# Altium schematic sheet W5500_2.SchDoc
size A4
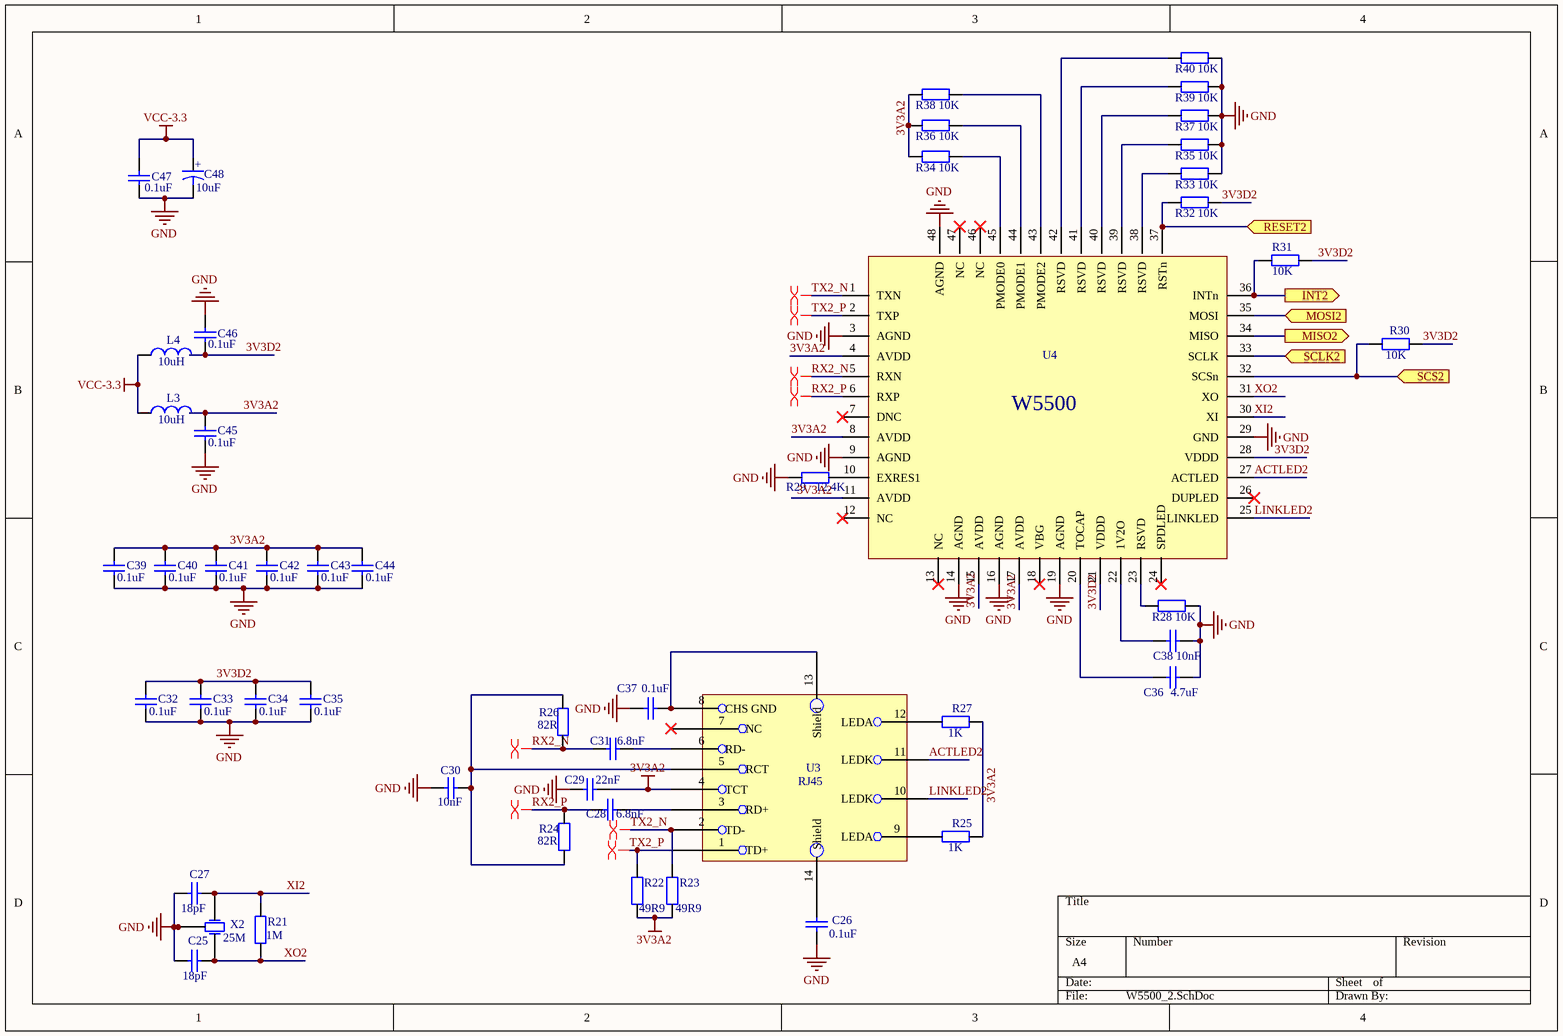
[diagram p0: W5500_2.SchDoc]

## Parts
C25  value 18pF  [0603]  (hidden comment: Capacitor-0603)
C26  value 0.1uF  [0603]  (hidden comment: Capacitor-0603)
C27  value 18pF  [0603]  (hidden comment: Capacitor-0603)
C28  value 6.8nF  [0603]  (hidden comment: Capacitor-0603)
C29  value 22nF  [0603]  (hidden comment: Capacitor-0603)
C30  value 10nF  [0603]  (hidden comment: Capacitor-0603)
C31  value 6.8nF  [0603]  (hidden comment: Capacitor-0603)
C32  value 0.1uF  [0603]  (hidden comment: Capacitor-0603)
C33  value 0.1uF  [0603]  (hidden comment: Capacitor-0603)
C34  value 0.1uF  [0603]  (hidden comment: Capacitor-0603)
C35  value 0.1uF  [0603]  (hidden comment: Capacitor-0603)
C36  value 4.7uF  [0603]  (hidden comment: Capacitor-0805)
C37  value 0.1uF  [0603]  (hidden comment: Capacitor-0603)
C38  value 10nF  [0603]  (hidden comment: Capacitor-0603)
C39  value 0.1uF  [0603]  (hidden comment: Capacitor-0603)
C40  value 0.1uF  [0603]  (hidden comment: Capacitor-0603)
C41  value 0.1uF  [0603]  (hidden comment: Capacitor-0603)
C42  value 0.1uF  [0603]  (hidden comment: Capacitor-0603)
C43  value 0.1uF  [0603]  (hidden comment: Capacitor-0603)
C44  value 0.1uF  [0603]  (hidden comment: Capacitor-0603)
C45  value 0.1uF  [0603]  (hidden comment: Capacitor-0603)
C46  value 0.1uF  [0603]  (hidden comment: Capacitor-0603)
C47  value 0.1uF  [0603]  (hidden comment: Capacitor-0603)
C48  value 10uF  [钽电容1206（A3216）]  (hidden comment: 电解电容)
L3  value 10uH  [0805]  (hidden comment: Inductor)
L4  value 10uH  [0805]  (hidden comment: Inductor)
R21  value 1M  [0603]  (hidden comment: Resistor-0603)
R22  value 49R9  [0603]  (hidden comment: Resistor-0603)
R23  value 49R9  [0603]  (hidden comment: Resistor-0603)
R24  value 82R  [0603]  (hidden comment: Resistor-0603)
R25  value 1K  [0603]  (hidden comment: Resistor-0603)
R26  value 82R  [0603]  (hidden comment: Resistor-0603)
R27  value 1K  [0603]  (hidden comment: Resistor-0603)
R28  value 10K  [0603]  (hidden comment: Resistor-0603)
R29  value 12.4K  [0603]  (hidden comment: Resistor-0603)
R30  value 10K  [0603]  (hidden comment: Resistor-0603)
R31  value 10K  [0603]  (hidden comment: Resistor-0603)
R32  value 10K  [0603]  (hidden comment: Resistor-0603)
R33  value 10K  [0603]  (hidden comment: Resistor-0603)
R34  value 10K  [0603]  (hidden comment: Resistor-0603)
R35  value 10K  [0603]  (hidden comment: Resistor-0603)
R36  value 10K  [0603]  (hidden comment: Resistor-0603)
R37  value 10K  [0603]  (hidden comment: Resistor-0603)
R38  value 10K  [0603]  (hidden comment: Resistor-0603)
R39  value 10K  [0603]  (hidden comment: Resistor-0603)
R40  value 10K  [0603]  (hidden comment: Resistor-0603)
U3  RJ45  [RJ45]
U4  W5500  [W5500]  (value not drawn)
X2  value 25M  [3225无源晶振]  (hidden comment: 3225无源晶振)

## Ports
INT2 (out), MISO2 (out), MOSI2 (in), RESET2 (in), SCLK2 (in), SCS2 (in)

## Nets
3V3A2: C29.2 C39.1 C40.1 C41.1 C42.1 C43.1 C44.1 C45.1 L3.2 R22.2 R23.2 R25.2 R27.2 R34.2 R36.2 R38.2 U3.4(TCT) U4.4(AVDD) U4.8(AVDD) U4.11(AVDD) U4.15(AVDD) U4.17(AVDD)
GND: C25.1 C26.2 C27.1 C29.1 C30.1 C32.2 C33.2 C34.2 C35.2 C36.2 C37.2 C38.1 C39.2 C40.2 C41.2 C42.2 C43.2 C44.2 C45.2 C46.2 C47.1 C48.1 R28.1 R29.2 R33.1 R35.1 R37.1 R39.1 R40.1 U4.3(AGND) U4.9(AGND) U4.14(AGND) U4.16(AGND) U4.19(AGND) U4.29(GND) U4.48(AGND) X2.2(GND) X2.4(GND)
VCC-3.3: C47.2 C48.2 L3.1 L4.1
3V3D2: C32.1 C33.1 C34.1 C35.1 C46.1 L4.2 R30.2 R31.2 R32.1 U4.21(VDDD) U4.28(VDDD)
ACTLED2: U3.11(LEDK) U4.27(ACTLED)
INT2: R31.1 U4.36(INTn) ; port INT2
LINKLED2: U3.10(LEDK) U4.25(LINKLED)
MISO2: U4.34(MISO) ; port MISO2
MOSI2: U4.35(MOSI) ; port MOSI2
RESET2: R32.2 U4.37(RSTn) ; port RESET2
RX2_N: C31.1 R26.2 U4.5(RXN)
RX2_P: C28.1 R24.1 U4.6(RXP)
SCLK2: U4.33(SCLK) ; port SCLK2
SCS2: R30.1 U4.32(SCSn) ; port SCS2
TX2_N: R23.1 U3.2(TD-) U4.1(TXN)
TX2_P: R22.1 U3.1(TD+) U4.2(TXP)
XI2: C27.2 R21.1 U4.30(XI) X2.1(OSC1)
XO2: C25.2 R21.2 U4.31(XO) X2.3(OSC2)
NetC26_1: C26.1 U3.14(Shield)
NetC28_2: C28.2 U3.3(RD+)
NetC30_2: C30.2 R24.2 R26.1 U3.5(RCT)
NetC31_2: C31.2 U3.6(RD-)
NetC36_1: C36.1 U4.20(TOCAP)
NetC37_1: C37.1 U3.8(CHS_GND) U3.13(Shield)
NetC38_2: C38.2 U4.22(1V2O)
NetR25_1: R25.1 U3.9(LEDA)
NetR27_1: R27.1 U3.12(LEDA)
NetR28_2: R28.2 U4.23(RSVD)
NetR29_1: R29.1 U4.10(EXRES1)
NetR33_2: R33.2 U4.38(RSVD)
NetR34_1: R34.1 U4.45(PMODE0)
NetR35_2: R35.2 U4.39(RSVD)
NetR36_1: R36.1 U4.44(PMODE1)
NetR37_2: R37.2 U4.40(RSVD)
NetR38_1: R38.1 U4.43(PMODE2)
NetR39_2: R39.2 U4.41(RSVD)
NetR40_2: R40.2 U4.42(RSVD)

Not connected (* = marked no-connect by the designer): U3 7(NC)*; U4 7(DNC)* 12(NC)* 13(NC)* 18(VBG)* 24(SPDLED)* 26(DUPLED)* 46(NC)* 47(NC)*

## Layout directives
differential pair: RX2_N, RX2_P, TX2_N, TX2_P

## Notes on the sheet
- (in symbol 电解电容) +

## Library data of the parts
U3 = RJ45: Name: RJ45
U4 = W5500: Name: W5500